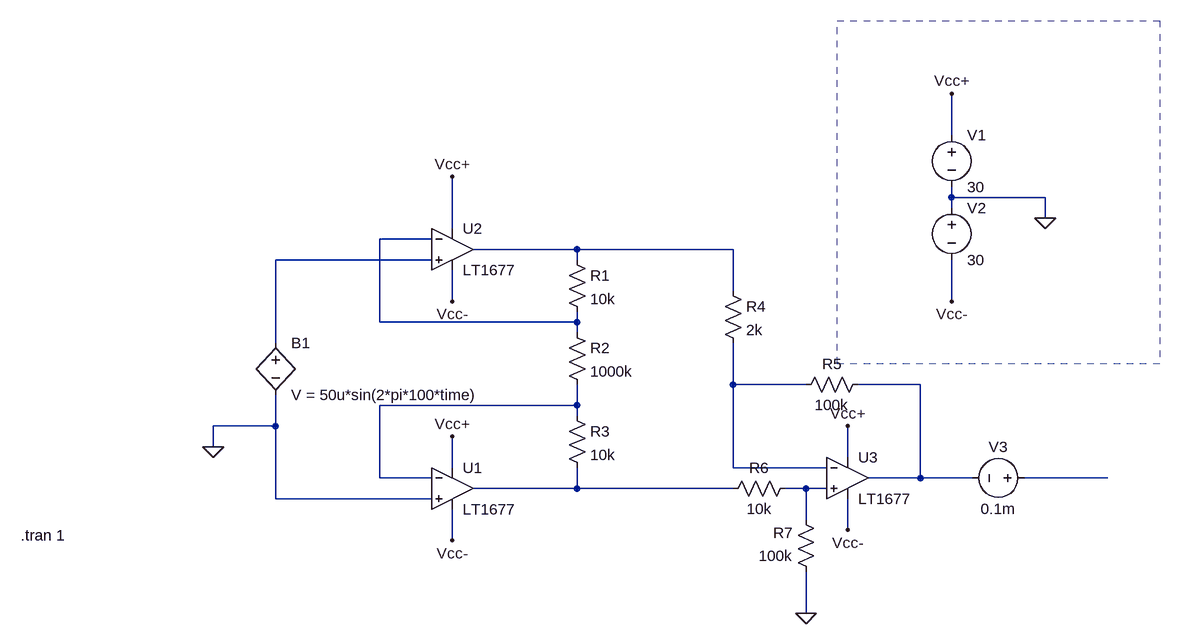
[diagram p0: schematic INA50x.asc]
INA50x.asc, the LTspice schematic file:
Version 4.1
SHEET 1 1268 680
WIRE 944 -400 944 -464
WIRE 944 -304 944 -320
WIRE 1088 -304 944 -304
WIRE 944 -288 944 -304
WIRE 1088 -272 1088 -304
WIRE 176 -256 176 -336
WIRE 144 -240 64 -240
WIRE 368 -224 208 -224
WIRE 608 -224 368 -224
WIRE 144 -208 -96 -208
WIRE 368 -208 368 -224
WIRE 608 -160 608 -224
WIRE 176 -144 176 -192
WIRE 944 -144 944 -208
WIRE 64 -112 64 -240
WIRE 368 -112 368 -128
WIRE 368 -112 64 -112
WIRE 368 -96 368 -112
WIRE -96 -80 -96 -208
WIRE 608 -16 608 -80
WIRE 720 -16 608 -16
WIRE 896 -16 800 -16
WIRE 368 16 368 -16
WIRE 368 16 64 16
WIRE 368 32 368 16
WIRE -96 48 -96 0
WIRE -96 48 -192 48
WIRE -192 80 -192 48
WIRE 784 96 784 48
WIRE 176 112 176 64
WIRE 608 112 608 -16
WIRE 752 112 608 112
WIRE 64 128 64 16
WIRE 144 128 64 128
WIRE 896 128 896 -16
WIRE 896 128 816 128
WIRE 976 128 896 128
WIRE 1184 128 1056 128
WIRE 368 144 368 112
WIRE 368 144 208 144
WIRE 608 144 368 144
WIRE 720 144 688 144
WIRE 752 144 720 144
WIRE -96 160 -96 48
WIRE 144 160 -96 160
WIRE 720 192 720 144
WIRE 784 208 784 160
WIRE 176 224 176 176
WIRE 720 336 720 272
FLAG 1088 -272 0
FLAG 944 -464 Vcc+
FLAG 944 -144 Vcc-
FLAG 176 -336 Vcc+
FLAG 176 64 Vcc+
FLAG 784 48 Vcc+
FLAG 176 -144 Vcc-
FLAG 176 224 Vcc-
FLAG 784 208 Vcc-
FLAG -192 80 0
FLAG 720 336 0
SYMBOL OpAmps\\LT1677 176 80 R0
SYMATTR InstName U1
SYMBOL OpAmps\\LT1677 176 -288 R0
SYMATTR InstName U2
SYMBOL OpAmps\\LT1677 784 64 R0
SYMATTR InstName U3
SYMBOL res 352 -224 R0
SYMATTR InstName R1
SYMATTR Value 10k
SYMBOL res 352 -112 R0
SYMATTR InstName R2
SYMATTR Value 1000k
SYMBOL res 352 16 R0
SYMATTR InstName R3
SYMATTR Value 10k
SYMBOL res 592 -176 R0
SYMATTR InstName R4
SYMATTR Value 2k
SYMBOL res 816 -32 R90
WINDOW 0 0 56 VBottom 2
WINDOW 3 32 56 VTop 2
SYMATTR InstName R5
SYMATTR Value 100k
SYMBOL res 704 128 R90
WINDOW 0 0 56 VBottom 2
WINDOW 3 32 56 VTop 2
SYMATTR InstName R6
SYMATTR Value 10k
SYMBOL res 736 288 R180
WINDOW 0 36 76 Left 2
WINDOW 3 36 40 Left 2
SYMATTR InstName R7
SYMATTR Value 100k
SYMBOL voltage 944 -416 R0
SYMATTR InstName V1
SYMATTR Value 30
SYMBOL voltage 944 -304 R0
SYMATTR InstName V2
SYMATTR Value 30
SYMBOL bv -96 -96 R0
SYMATTR InstName B1
SYMATTR Value V = 50u*sin(2*pi*100*time)
SYMBOL voltage 1072 128 R90
WINDOW 0 -32 56 VBottom 2
WINDOW 3 32 56 VTop 2
SYMATTR InstName V3
SYMATTR Value 0.1m
TEXT -488 216 Left 2 !.tran 1
RECTANGLE Normal 1264 -48 768 -576 2

The netlist it stands for:
* INA50x.asc
X§U1 0 N006 Vcc+ Vcc- N008 LT1677  ; pins In+ In- V+ V- OUT
X§U2 N003 N001 Vcc+ Vcc- N002 LT1677  ; pins In+ In- V+ V- OUT
X§U3 N009 N004 Vcc+ Vcc- N005 LT1677  ; pins In+ In- V+ V- OUT
R1 N002 N001 10k
R2 N001 N006 1000k
R3 N006 N008 10k
R4 N002 N004 2k
R5 N005 N004 100k
R6 N009 N008 10k
R7 0 N009 100k
V1 Vcc+ 0 30
V2 0 Vcc- 30
B1 N003 0 V = 50u*sin(2*pi*100*time)
V3 N007 N005 0.1m
.tran 1
.lib LTC.lib
.backanno
.end